# EAGLE schematic VoiceInterface (EAGLE 9.6.2)
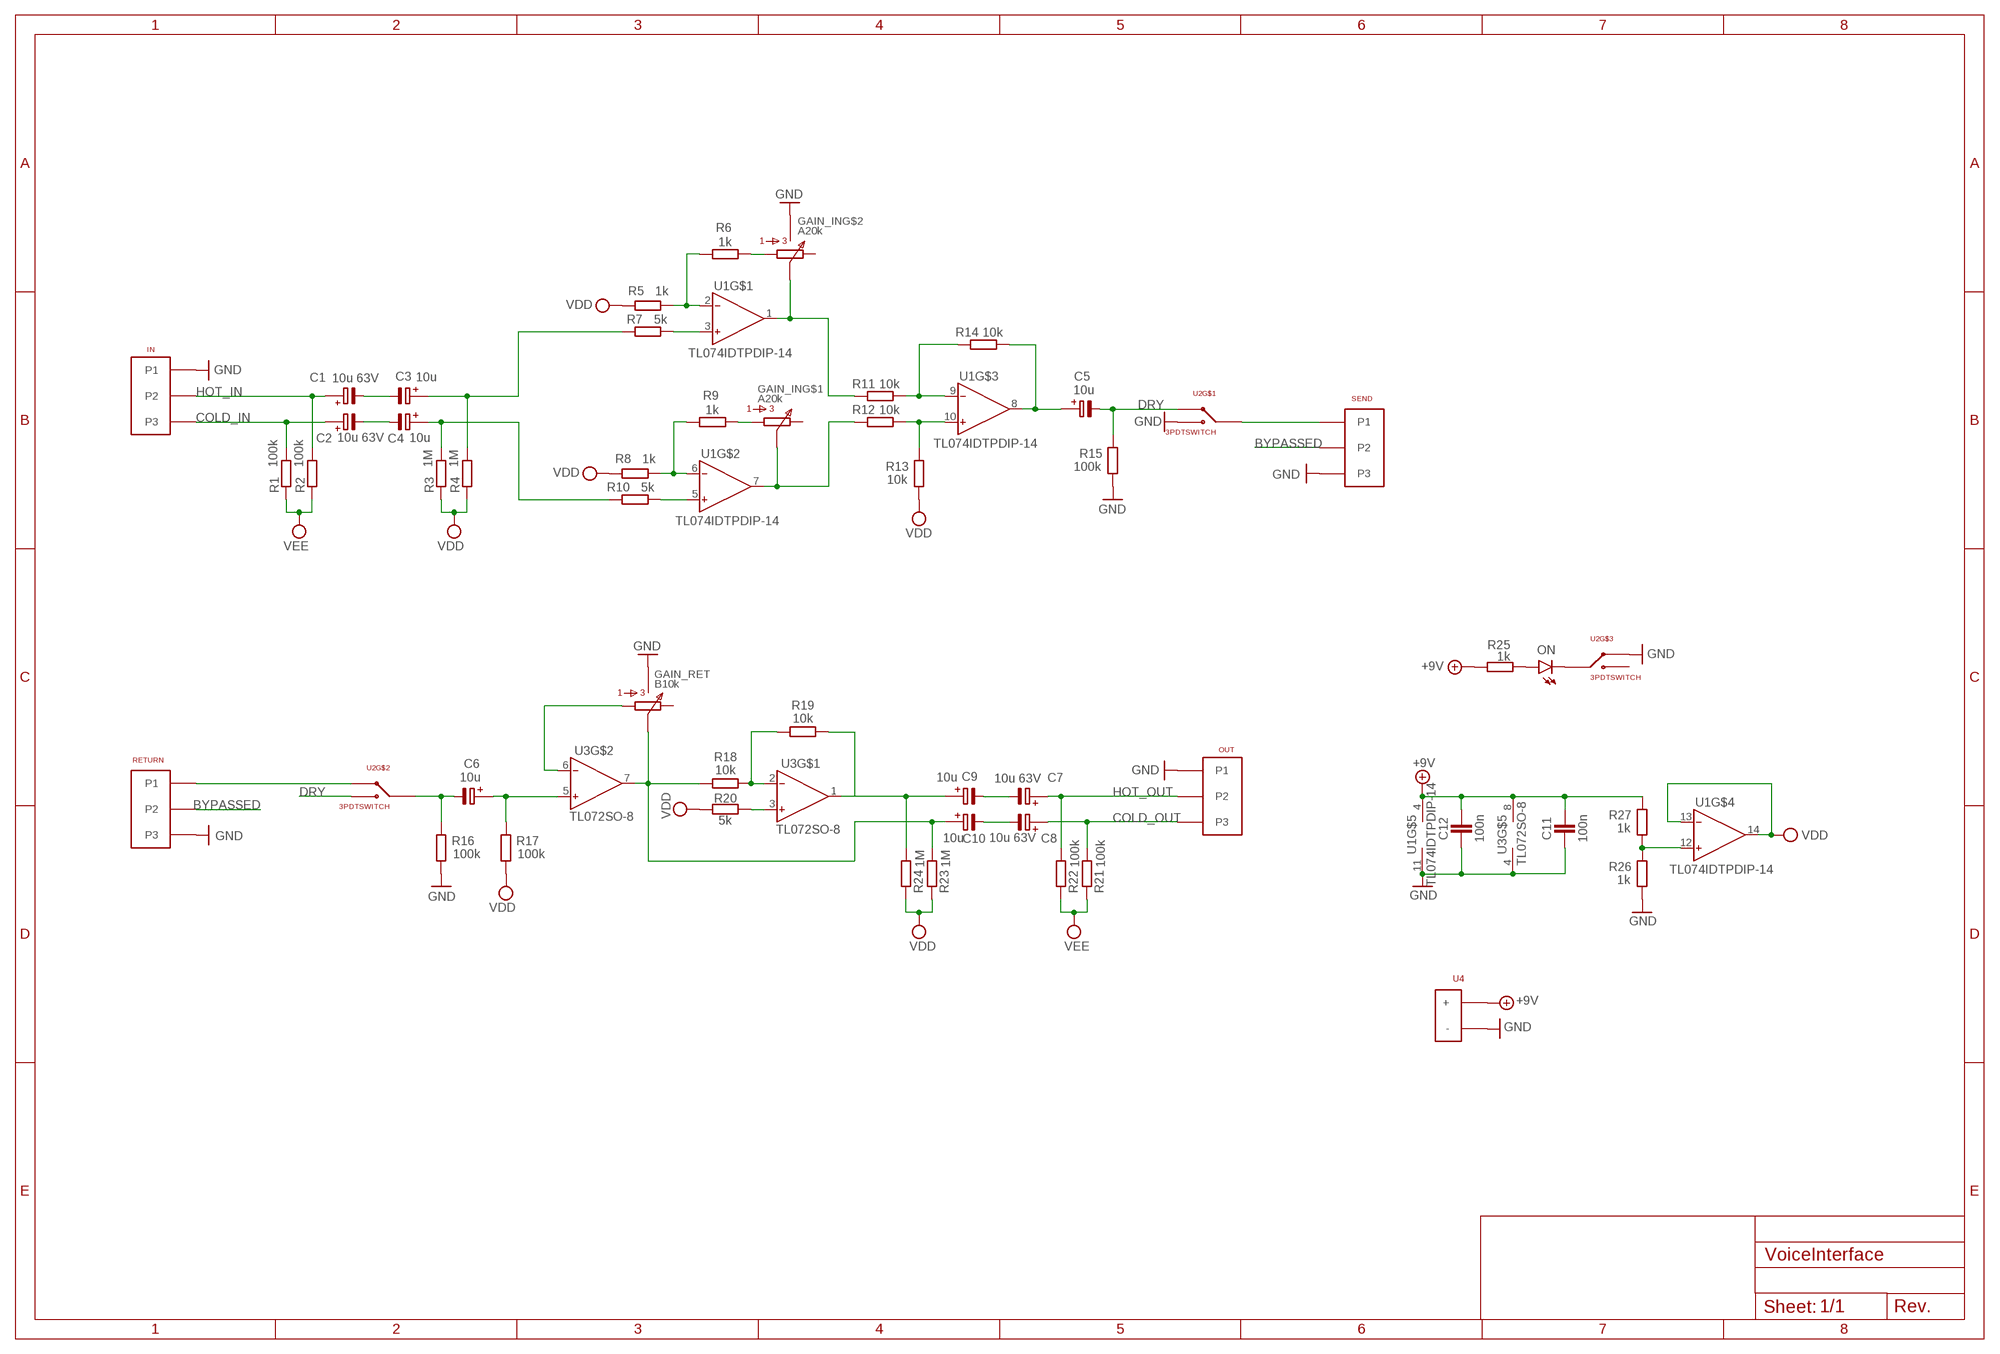
[diagram p0: schematic, sheet 1]

## Parts
C1  10u 63V  ELECT_CAPACITORCAP10  [UD-8X10_NICHICON]
C2  10u 63V  ELECT_CAPACITORCAP10  [UD-8X10_NICHICON]
C3  10u  ELECT_CAPACITORCAP6  [UD-4X5,8_NICHICON]
C4  10u  ELECT_CAPACITORCAP6  [UD-4X5,8_NICHICON]
C5  10u  ELECT_CAPACITORCAP6  [UD-4X5,8_NICHICON]
C6  10u  ELECT_CAPACITORCAP6  [UD-4X5,8_NICHICON]
C7  10u 63V  ELECT_CAPACITORCAP10  [UD-8X10_NICHICON]
C8  10u 63V  ELECT_CAPACITORCAP10  [UD-8X10_NICHICON]
C9  10u  ELECT_CAPACITORCAP6  [UD-4X5,8_NICHICON]
C10  10u  ELECT_CAPACITORCAP6  [UD-4X5,8_NICHICON]
C11  100n  CAPACITORC-0603  [0603]
C12  100n  CAPACITORC-0603  [0603]
GAIN_IN  A20k  STEREO_POT  [P0925N]
GAIN_RET  B10k  POT  [P0915N]
IN  3_PIN_PORT  [3_PIN_PORT]
ON  LEDLED_THROUGH  [LED3MM]
OUT  3_PIN_PORT  [3_PIN_PORT]
R1  100k  RESISTOR  [R0603]
R2  100k  RESISTOR  [R0603]
R3  1M  RESISTOR  [R0603]
R4  1M  RESISTOR  [R0603]
R5  1k  RESISTOR  [R0603]
R6  1k  RESISTOR  [R0603]
R7  5k  RESISTOR  [R0603]
R8  1k  RESISTOR  [R0603]
R9  1k  RESISTOR  [R0603]
R10  5k  RESISTOR  [R0603]
R11  10k  RESISTOR  [R0603]
R12  10k  RESISTOR  [R0603]
R13  10k  RESISTOR  [R0603]
R14  10k  RESISTOR  [R0603]
R15  100k  RESISTOR  [R0603]
R16  100k  RESISTOR  [R0603]
R17  100k  RESISTOR  [R0603]
R18  10k  RESISTOR  [R0603]
R19  10k  RESISTOR  [R0603]
R20  5k  RESISTOR  [R0603]
R21  100k  RESISTOR  [R0603]
R22  100k  RESISTOR  [R0603]
R23  1M  RESISTOR  [R0603]
R24  1M  RESISTOR  [R0603]
R25  1k  RESISTOR  [R0603]
R26  1k  RESISTOR  [R0603]
R27  1k  RESISTOR  [R0603]
RETURN  3_PIN_PORT  [3_PIN_PORT]
SEND  3_PIN_PORT  [3_PIN_PORT]
U1  TL074IDTPDIP-14  [SOIC127P600X175-14N]
U2  3PDTSWITCH  [FS57003PLT2B2M1QE]
U3  TL072SO-8  [SOIC127P600X175-8N]
U4  POWER  [POWER]

## Nets
+9V: C11.2 C12.2 R25.2 R27.1 U1.4(V+) U3.8(V+) U4.P$1(+)
BYPASSED: RETURN.P$2(P2) SEND.P$2(P2)
COLD_IN: C2.+ IN.P$3(P3) R1.2
COLD_OUT: C8.+ OUT.P$3(P3) R21.2
DRY: C5.- R15.1 U2.P$1 U2.P$6
DRY1: C6.- R16.1 U2.P$5
GND: C11.1 C12.1 GAIN_IN.P$7 GAIN_IN.P$8 GAIN_RET.P$7 GAIN_RET.P$8 IN.P$1(P1) OUT.P$1(P1) R15.2 R16.2 R26.2 RETURN.P$3(P3) SEND.P$3(P3) U1.11(V-) U2.P$3 U2.P$7 U3.4(V-) U4.P$2(-)
HOT_IN: C1.+ IN.P$2(P2) R2.2
HOT_OUT: C7.+ OUT.P$2(P2) R22.2
N$1: R11.1 R14.2 U1.9(IN-)
N$2: R12.1 R13.1 U1.10(IN+)
N$3: C1.- C3.-
N$4: C2.- C4.-
N$5: C4.+ R3.2 R10.2
N$6: C3.+ R4.2 R7.2
N$7: R5.1 R6.2 U1.2(IN-)
N$8: GAIN_IN.P$4 R6.1
N$9: R7.1 U1.3(IN+)
N$10: GAIN_IN.P$5 R11.2 U1.1(OUT)
N$11: R8.1 R9.2 U1.6(IN-)
N$12: GAIN_IN.P$1 R9.1
N$13: GAIN_IN.P$2 R12.2 U1.7(OUT)
N$14: R10.1 U1.5(IN+)
N$15: C5.+ R14.1 U1.8(OUT)
N$16: SEND.P$1(P1) U2.P$2
N$17: RETURN.P$1(P1) U2.P$4
N$18: C6.+ R17.1 U3.5(IN+)
N$19: ON.K(C) U2.P$8
N$20: R18.1 R19.2 U3.2(IN-)
N$21: GAIN_RET.P$1 U3.6(IN-)
N$22: ON.A R25.1
N$23: R20.1 U3.3(IN+)
N$24: C7.- C9.-
N$25: C8.- C10.-
N$26: C10.+ GAIN_RET.P$2 R18.2 R23.2 U3.7(OUT)
N$27: C9.+ R19.1 R24.2 U3.1(OUT)
N$28: R26.1 R27.2 U1.12(IN+)
VDD: R3.1 R4.1 R5.2 R8.2 R13.2 R17.2 R20.2 R23.1 R24.1 U1.13(IN-) U1.14(OUT)
VEE: R1.1 R2.1 R21.1 R22.1
Unconnected: GAIN_IN.P$3 GAIN_IN.P$6 GAIN_RET.P$3 U2.P$9

## Library data of the parts
C1-C10 = library:ELECT_CAPACITOR
C11 C12 = library:CAPACITOR: Capacitor
GAIN_IN = library:STEREO_POT: Stereo Pot Potentiometers 1/40W 100K Ohms 20% 9mm ROTARY POT; LINK: https://www.mouser.se/ProductDetail/BI-Technologies-TT-Electronics/P0925N-FC20AR100K?qs=56eeD6vBg8iu%252BaH%2FeiwqGQ%3D%3D; MOUSERNR: 858-P0925NFC20AR100K; MPN: P0925N-FC20AR100K; SUPPLIER: Mouser
GAIN_RET = library:POT: Potentiometer Potentiometers 1/40W 100K Ohms 20% 9mm ROTARY POT; LINK: https://www.mouser.se/ProductDetail/BI-Technologies-TT-Electronics/P0915N-QC15AR100K?qs=xIkB7y1OTopi6Zs8qG7IZg%3D%3D; MOUSERNR: 858-P0915NQC15AR100K; MPN: P0915N-QC15AR100K; SUPPLIER: Mouser
IN OUT RETURN SEND = library:3_PIN_PORT
ON = library:LED
R1-R27 = library:RESISTOR
U1 = library:TL074IDT: Low noise JFET quad operational amplifier; LINK: https://www.mouser.se/ProductDetail/Texas-Instruments/TL074ACNE4?qs=odmYgEirbwz65PB0zQNngg%3D%3D; MOUSERNR: 595-TL074ACNE4; MPN: TL074ACNE4; SUPPLIER: Mouser
U2 = library:3PDTSWITCH: 3PDT Switch Pushbutton Switches High Actuation Foot Switch 10mm dia Actuator, 11.5mm Bushing, 1A 9VDC, 3 Pole, 3000gf, Alternate Action / Maintained, Solder Lug; LINK: https://www.mouser.se/ProductDetail/E-Switch/FS57003PLT2B2M1QE?qs=1mbolxNpo8d2%2F%2FtsGmxrBA%3D%3D; MOUSERNR: 612-FS573PLT2B2M1QE; MPN: FS57003PLT2B2M1QE; SUPPLIER: Mouser
U3 = library:TL072: Low noise JFET quad operational amplifier
U4 = library:POWER